# Altium schematic sheet 400_FLAHS_MEMORY.SchDoc: FLASH MEMORY
size A4; DocumentNumber: 6; SheetNumber: 6; SheetTotal: 6
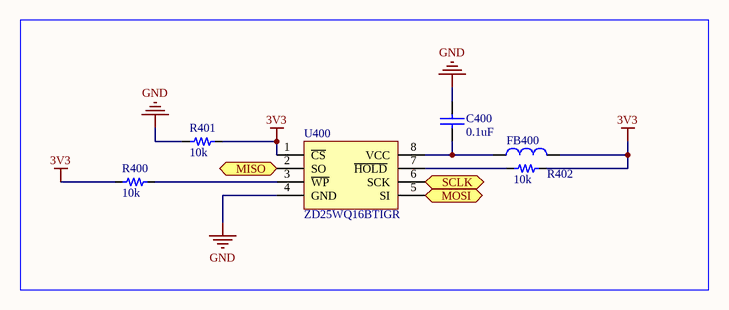
[diagram p0: 400_FLAHS_MEMORY.SchDoc]

## Parts
C400  value 0.1uF  [0603_cap]  (hidden comment: 0.1uF 50V)
FB400  60OHM 2A  [0603_fb]  (value not drawn)
R400  value 10k  [0603_res]  (hidden comment: 10k 1/10W)
R401  value 10k  [0603_res]  (hidden comment: 10k 1/10W)
R402  value 10k  [0603_res]  (hidden comment: 10k 1/10W)
U400  ZD25WQ16BTIGR  [SOIC_8_3.9mm]

## Ports
MISO (bidir, see MAIN[3C], 300_MCU[3A]), MOSI (bidir, see MAIN[3C], 300_MCU[3A]), SCLK (bidir, see MAIN[3C], 300_MCU[3A])

## Nets
3V3: FB400.2 R400.1 R401.2 R402.2 U400.1(~{CS})
GND: C400.2 R401.1 U400.4(GND)
MISO: U400.2(SO) ; port MISO
MOSI: U400.5(SI) ; port MOSI
SCLK: U400.6(SCK) ; port SCLK
NetC400_1: C400.1 FB400.1 U400.8(VCC)
NetR400_2: R400.2 U400.3(~{WP})
NetR402_1: R402.1 U400.7(~{HOLD})

## Notes on the sheet
- Title
- Size:
- Date:
- A4
- Number:
- Time:
- Revision:
- Sheet
- of
- File:

## Library data of the parts
C400 = Cap_0.1uF_0603_50V: 50V 100nF Y5V -20%~+80% 0603 Multilayer Ceramic Capacitors MLCC - SMD/SMT ROHS; Manufacturer: Walsin Tech Corp; Manufacturer Part Number: 0603F104Z500CT; Supplier 1: LCSC; Supplier Part Number 1: C83060; ComponentLink1Description: LCSC; ComponentLink1URL: https://www.lcsc.com/product-detail/Multilayer-Ceramic-Capacitors-MLCC-SMD-SMT_Walsin-Tech-Corp-0603F104Z500CT_C83060.html
FB400 = FB_60_0603_2A: 2A 1 100mΩ 60Ω@100MHz ±25% 0603 Ferrite Beads ROHS; Manufacturer: TAI-TECH; Manufacturer Part Number: HCB1608KF-600T20; ComponentLink1Description: LCSC; ComponentLink1URL: https://www.lcsc.com/product-detail/Ferrite-Beads_TAI-TECH-HCB1608KF-600T20_C369516.html; Supplier 1: LCSC; Supplier Part Number 1: C369516
R400-R402 = Res_10k_0603_1/10W: RES SMD 10k OHM 5% 1/10W 0603; Manufacturer: FOJAN; Manufacturer Part Number: FRC0603J103TS; ComponentLink1URL: https://www.lcsc.com/product-detail/Chip-Resistor-Surface-Mount_FOJAN-FRC0603J103TS_C2930027.html; Supplier 1: LCSC; Supplier Part Number 1: C2930027; ComponentLink1Description: LCSC
U400 = IC_FLASH_ZD25WQ16BTIGR_8SOP: IC FLASH 16M SPI 85MHZ 8SOP; Manufacturer: Zetta; Manufacturer Part Number: ZD25WQ16BTIGR; Supplier 1: LCSC; Supplier Part Number 1: C2896790; ComponentLink1Description: LCSC; ComponentLink1URL: https://www.lcsc.com/product-detail/NOR-FLASH_Zetta-ZD25WQ16BTIGR_C2896790.html